# EAGLE design untitled (EAGLE 6.4)
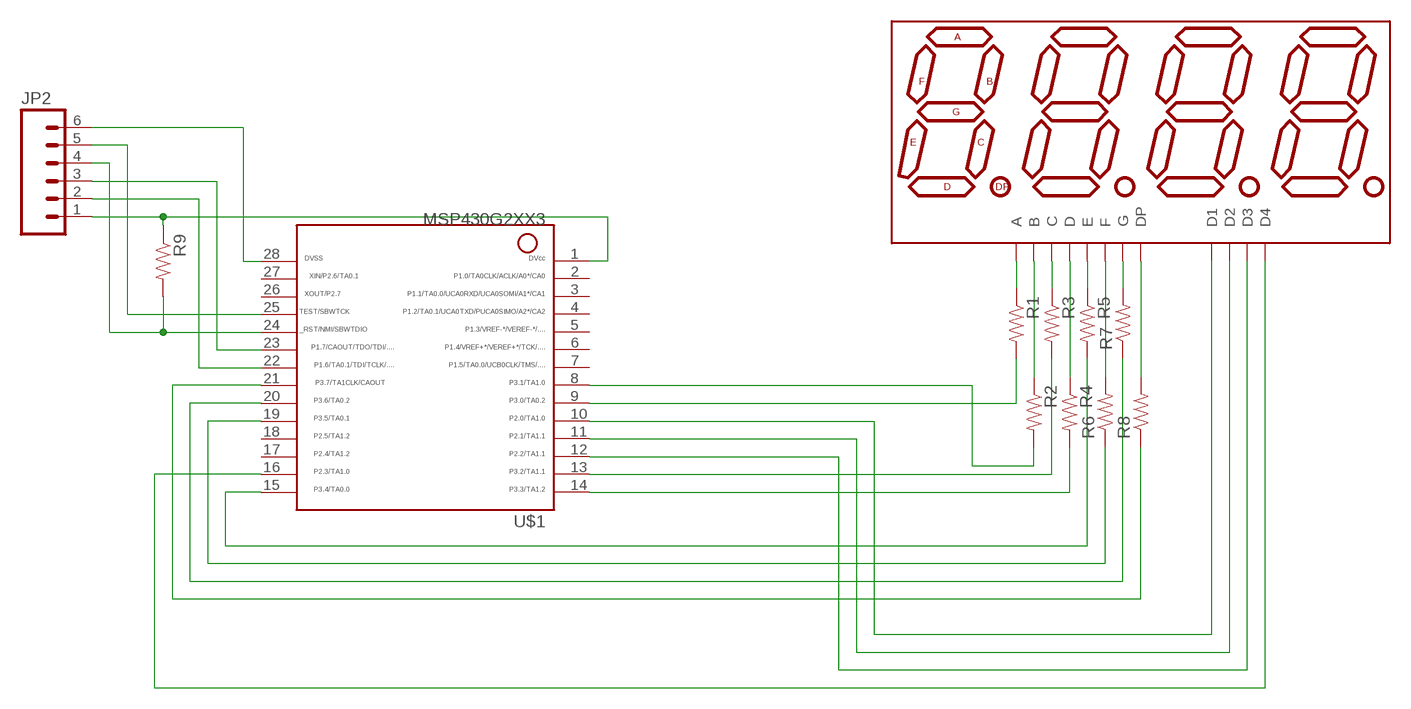
[diagram p0: schematic, sheet 1]

## Parts
JP2  M06LOCK  [1X06_LOCK]
R1  RESISTOR1206  [1206]
R2  RESISTOR1206  [1206]
R3  RESISTOR1206  [1206]
R4  RESISTOR1206  [1206]
R5  RESISTOR1206  [1206]
R6  RESISTOR1206  [1206]
R7  RESISTOR1206  [1206]
R8  RESISTOR1206  [1206]
R9  RESISTOR1206  [1206]
U$1  G2XX3---PW28  [PW28]
U$2  7-SEGMENT-4DIGIT-COUNTERPTH  [7-SEGMENT-4DIGIT-COUNTER]

## Nets
N$1: R1.1 U$2.11(A)
N$2: R2.1 U$2.7(B)
N$3: R3.1 U$2.4(C)
N$4: R4.1 U$2.2(D)
N$5: R5.1 U$2.1(E)
N$6: JP2.5 U$1.25
N$7: JP2.4 R9.2 U$1.24
N$8: JP2.6 U$1.28
N$9: R8.1 U$1.21
N$10: JP2.1 R9.1 U$1.1
N$11: JP2.2 U$1.22
N$12: R6.2 U$2.10(F)
N$13: R7.2 U$2.5(G)
N$14: R8.2 U$2.3(DP)
N$15: R1.2 U$1.9
N$16: R2.2 U$1.8
N$17: R3.2 U$1.13
N$18: R4.2 U$1.14
N$19: R5.2 U$1.15
N$20: R6.1 U$1.19
N$21: R7.1 U$1.20
N$22: JP2.3 U$1.23
N$23: U$1.10 U$2.12(D1)
N$24: U$1.11 U$2.9(D2)
N$25: U$1.12 U$2.8(D3)
N$26: U$1.16 U$2.6(D4)
Unconnected: U$1.2 U$1.3 U$1.4 U$1.5 U$1.6 U$1.7 U$1.17 U$1.18 U$1.26 U$1.27

## Library data of the parts
JP2 = SparkFun-Connectors:M06: Header 6 Standard 6-pin 0.1" header. Use with straight break away headers (SKU : PRT-00116), right angle break away headers (PRT-00553), swiss pins (PRT-00743), machine pins (PRT-00117), and female headers (PRT-00115). Molex polarized connector foot print use with SKU : PRT-08094 with associated crimp pins and housings. NOTES ON THE VARIANTS LOCK and LOCK_LONGPADS... This footprint was designed to help hold the alignment of a through-hole component (i.e. 6-pin header) while soldering it into place. You may notice that each hole has been shifted either up or down by 0.005 of an inch from it's more standard position (which is a perfectly straight line). This slight alteration caused the pins (the squares in the middle) to touch the edges of the holes. Because they are alternating, it causes a "brace" to hold the component in place. 0.005 has proven to be the perfect amount of "off-center" position when using our standard breakaway headers. Although looks a little odd when you look at the bare footprint, once you have a header in there, the alteration is very hard to notice. Also, if you push a header all the way into place, it is covered up entirely on the bottom side. This idea of altering the position of holes to aid alignment will be further integrated into the Sparkfun Library for other footprints. It can help hold any component with 3 or more connection pins.
R1-R9 = SparkFun-Passives:RESISTOR: Resistor Basic schematic elements and footprints for 0603, 1206, and PTH resistors.
U$1 = TI_MSP430_v16:G2XX3---PW28: MSP430G2XX1 TSSOP (PW) 28 Pin Package
U$2 = SparkFun-Displays:7-SEGMENT-4DIGIT-COUNTER

## Board
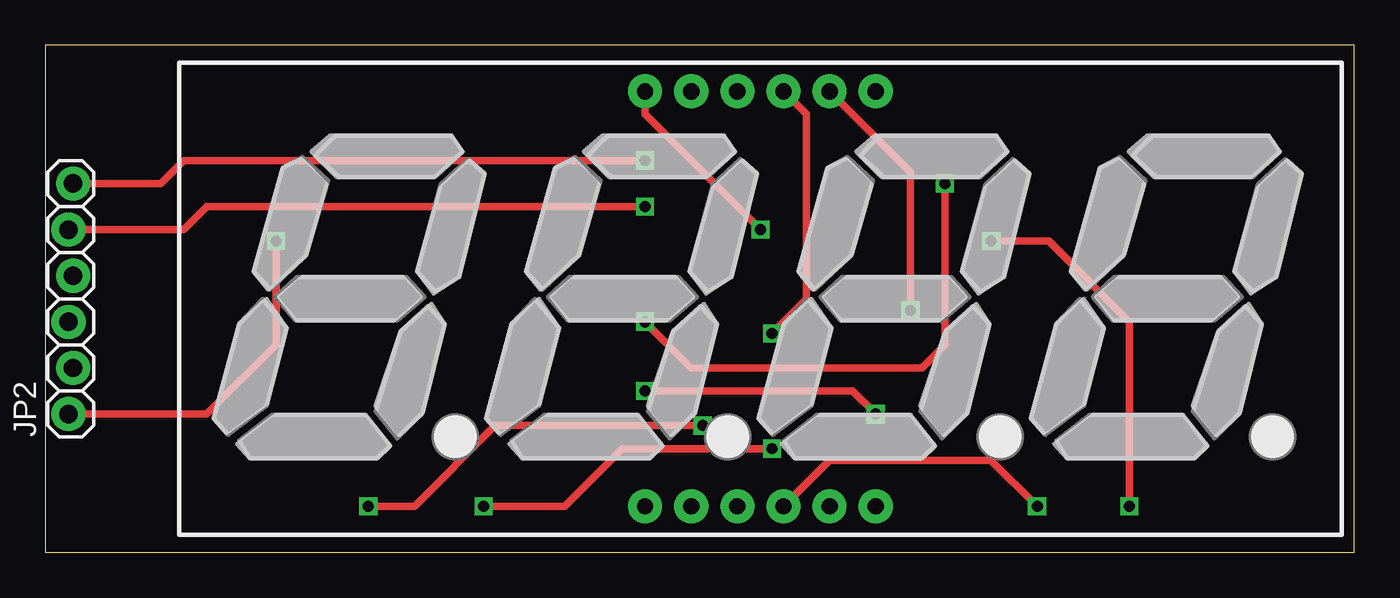
[diagram p1: board, top side]
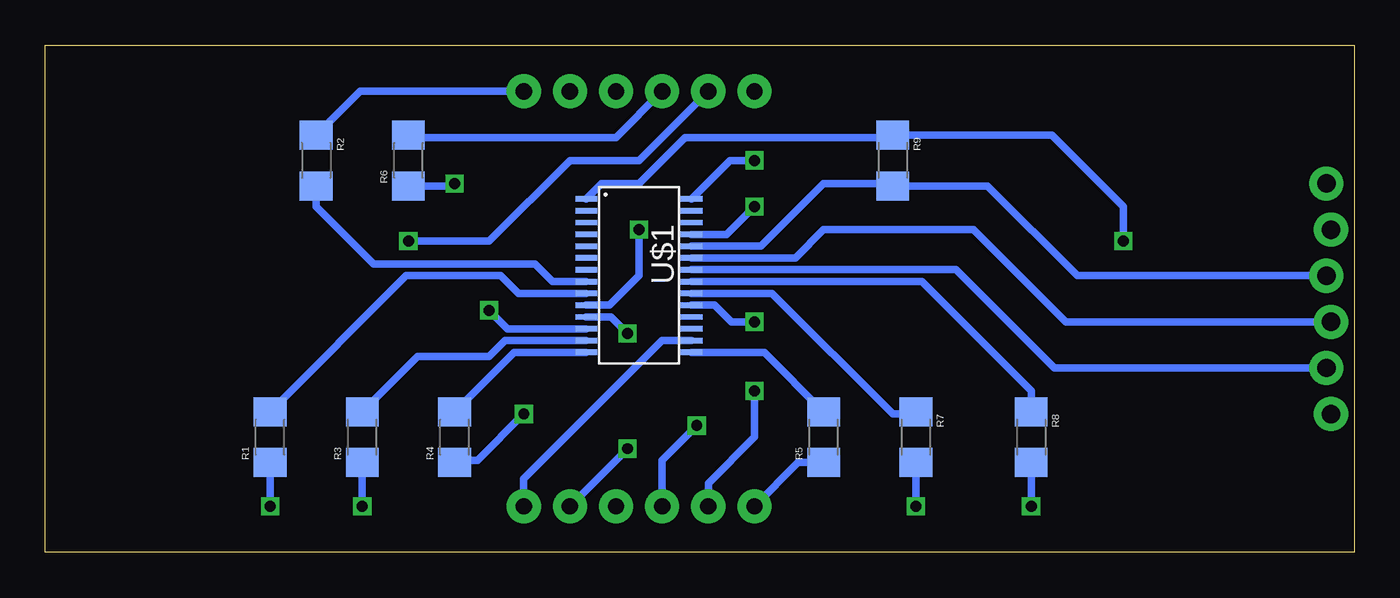
[diagram p2: board, bottom side, seen from below]

Size 72.06 x 27.93 mm. Coordinates in mm from the lower left corner, seen from the top.
Outline: 0,0 72.06,0 72.06,27.93 0,27.93 0,0
Copper layers (1*16): Top 0.035mm / dielectric 1.5mm / Bottom 0.035mm
Design rules "default": minimum track width 10mil, minimum drill 24mil, track to track 8mil, track to pad 8mil, pad to pad 8mil, via to via 8mil, smd to smd 8mil, copper to edge 40mil, drill to drill 8mil, minimum pad ring 10mil, minimum via ring 8mil, stop-mask expansion 4mil, vias tented up to drill 0mil, thermal gap 10mil

### Footprints (pad centres in the part's own frame; a part is rotated, then mirrored left to right if it is on the bottom)
1X06_LOCK = drill 1.016 pad 1.88: 1 0,0; 2 2.54,-0.254; 3 5.08,0; 4 7.62,-0.254; 5 10.16,0; 6 12.7,-0.254
1206 = smd 1.6 x 1.8: 1 -1.4,0; 2 1.4,0
PW28 = smd 0.3 x 1.2: 1 -4.229,-2.908; 2 -3.579,-2.908; 3 -2.929,-2.908; 4 -2.279,-2.908; 5 -1.629,-2.908; 6 -0.979,-2.908; 7 -0.329,-2.908; 8 0.321,-2.908; 9 0.971,-2.908; 10 1.621,-2.908; 11 2.271,-2.908; 12 2.921,-2.908; 13 3.571,-2.908; 14 4.221,-2.908; 15 4.221,2.892; 16 3.571,2.892; 17 2.921,2.892; 18 2.271,2.892; 19 1.621,2.892; 20 0.971,2.892; 21 0.321,2.892; 22 -0.329,2.892; 23 -0.979,2.892; 24 -1.629,2.892; 25 -2.279,2.892; 26 -2.929,2.892; 27 -3.579,2.892; 28 -4.229,2.892
7-SEGMENT-4DIGIT-COUNTER = drill 0.9 pad 1.88: 1 -6.35,-11.43; 2 -3.81,-11.43; 3 -1.27,-11.43; 4 1.27,-11.43; 5 3.81,-11.43; 6 6.35,-11.43; 7 6.35,11.43; 8 3.81,11.43; 9 1.27,11.43; 10 -1.27,11.43; 11 -3.81,11.43; 12 -6.35,11.43

### Placement (x,y rotation side)
JP2  1.27,7.62 90 top
R1  59.69,6.35 90 bottom
R2  57.15,21.59 270 bottom
R3  54.61,6.35 90 bottom
R4  49.53,6.35 90 bottom
R5  29.21,6.35 90 bottom
R6  52.07,21.59 90 bottom
R7  24.13,6.35 270 bottom
R8  17.78,6.35 270 bottom
R9  25.4,21.59 270 bottom
U$1  39.37,15.24 270 bottom
U$2  39.37,13.97 0 top

### Tracks (layer width: path | path; a pad name or v marks a point on that pad's centre or on a via)
N$1  (via drill 0.6)
  Top 0.406: v52.07,17.14 55.24,17.14 59.69,12.7 v59.69,2.54
  Bottom 0.406: U$2.11 39.37,21.59 43.18,21.59 47.62,17.14 v52.07,17.14 | v59.69,2.54 R1.1
N$2
  Bottom 0.406: U$2.7 54.74,25.4 R2.1
N$3  (via drill 0.6)
  Top 0.406: v54.61,2.54 52.07,5.08 43.18,5.08 U$2.4
  Bottom 0.406: R3.1 v54.61,2.54
N$4  (via drill 0.6)
  Top 0.406: v45.72,7.62 44.45,8.89 v33.02,8.89
  Bottom 0.406: R4.1 49.4,5.08 48.26,5.08 v45.72,7.62 | U$2.2 35.56,3.81 33.02,6.35 v33.02,8.89
N$5
  Bottom 0.406: R5.1 30.61,4.95 U$2.1
N$6  (via drill 0.6)
  Top 0.406: JP2.5 7.62,17.78 8.89,19.05 v33.02,19.05
  Bottom 0.406: U$1.25 34.55,17.52 v33.02,19.05
N$7
  Bottom 0.406: JP2.4 15.24,15.24 20.19,20.19 R9.2 25.53,20.32 29.21,20.32 32.66,16.87 U$1.24
N$8  (via drill 0.6)
  Top 0.406: JP2.6 6.35,20.32 7.62,21.59 v33.02,21.59
  Bottom 0.406: U$1.28 34.36,21.59 v33.02,21.59
N$9
  Bottom 0.406: U$1.21 23.81,14.92 17.78,8.89 R8.1
N$10  (via drill 0.6)
  Top 0.406: JP2.1 8.89,7.62 12.7,11.43 v12.7,17.14
  Bottom 0.406: U$1.1 41.43,20.32 39.37,20.32 36.83,22.86 25.53,22.86 R9.1 16.64,22.99 12.7,19.05 v12.7,17.14
N$11
  Bottom 0.406: U$1.22 21.92,15.57 16.51,10.16 JP2.2
N$12
  Bottom 0.406: U$2.10 40.64,22.86 51.94,22.86 R6.2
N$13  (via drill 0.6)
  Top 0.406: v40.01,5.71 31.75,5.71 28.57,2.54 v24.13,2.54
  Bottom 0.406: v24.13,2.54 R7.2 | U$2.5 v40.01,5.71
N$14  (via drill 0.6)
  Top 0.406: v17.78,2.54 20.32,2.54 24.77,6.99 v36.2,6.99
  Bottom 0.406: R8.2 v17.78,2.54 | v36.2,6.99 38.1,5.08 U$2.3
N$15
  Bottom 0.406: R1.2 52.2,15.24 46.99,15.24 46.02,14.27 U$1.9
N$16
  Bottom 0.406: R2.2 57.15,19.05 53.98,15.88 45.09,15.88 44.13,14.92 U$1.8
N$17
  Bottom 0.406: U$1.13 46.75,11.67 47.62,10.79 51.56,10.79 R3.2
N$18
  Bottom 0.406: U$1.14 46.26,11.02 R4.2
N$19
  Bottom 0.406: 29.34,7.62 R5.2 32.48,11.02 U$1.15
N$20  (via drill 0.6)
  Top 0.406: v49.53,20.32 49.53,11.43 48.26,10.16 35.56,10.16 v33.02,12.7
  Bottom 0.406: U$1.19 35.21,13.62 34.29,12.7 v33.02,12.7 | R6.1 49.66,20.19 v49.53,20.32
N$21
  Bottom 0.406: U$1.20 32.05,14.27 25.4,7.62 24.26,7.62 R7.1
N$22
  Bottom 0.406: U$1.23 30.77,16.22 29.21,17.78 20.95,17.78 15.88,12.7 JP2.3
N$23  (via drill 0.6)
  Top 0.406: U$2.12 33.02,24.13 v39.37,17.78
  Bottom 0.406: U$1.10 40.99,13.62 39.37,15.24 v39.37,17.78
N$24  (via drill 0.6)
  Top 0.406: U$2.9 41.91,24.13 41.91,13.97 v40.01,12.06
  Bottom 0.406: U$1.11 40.91,12.97 v40.01,12.06
N$25  (via drill 0.6)
  Top 0.406: U$2.8 47.62,20.95 v47.62,13.34
  Bottom 0.406: U$1.12 46.61,12.32 v47.62,13.34
N$26
  Bottom 0.406: U$1.16 38.1,11.67 45.72,4.05 U$2.6